# EAGLE schematic WeddingWidget-pogo (EAGLE 6.3)
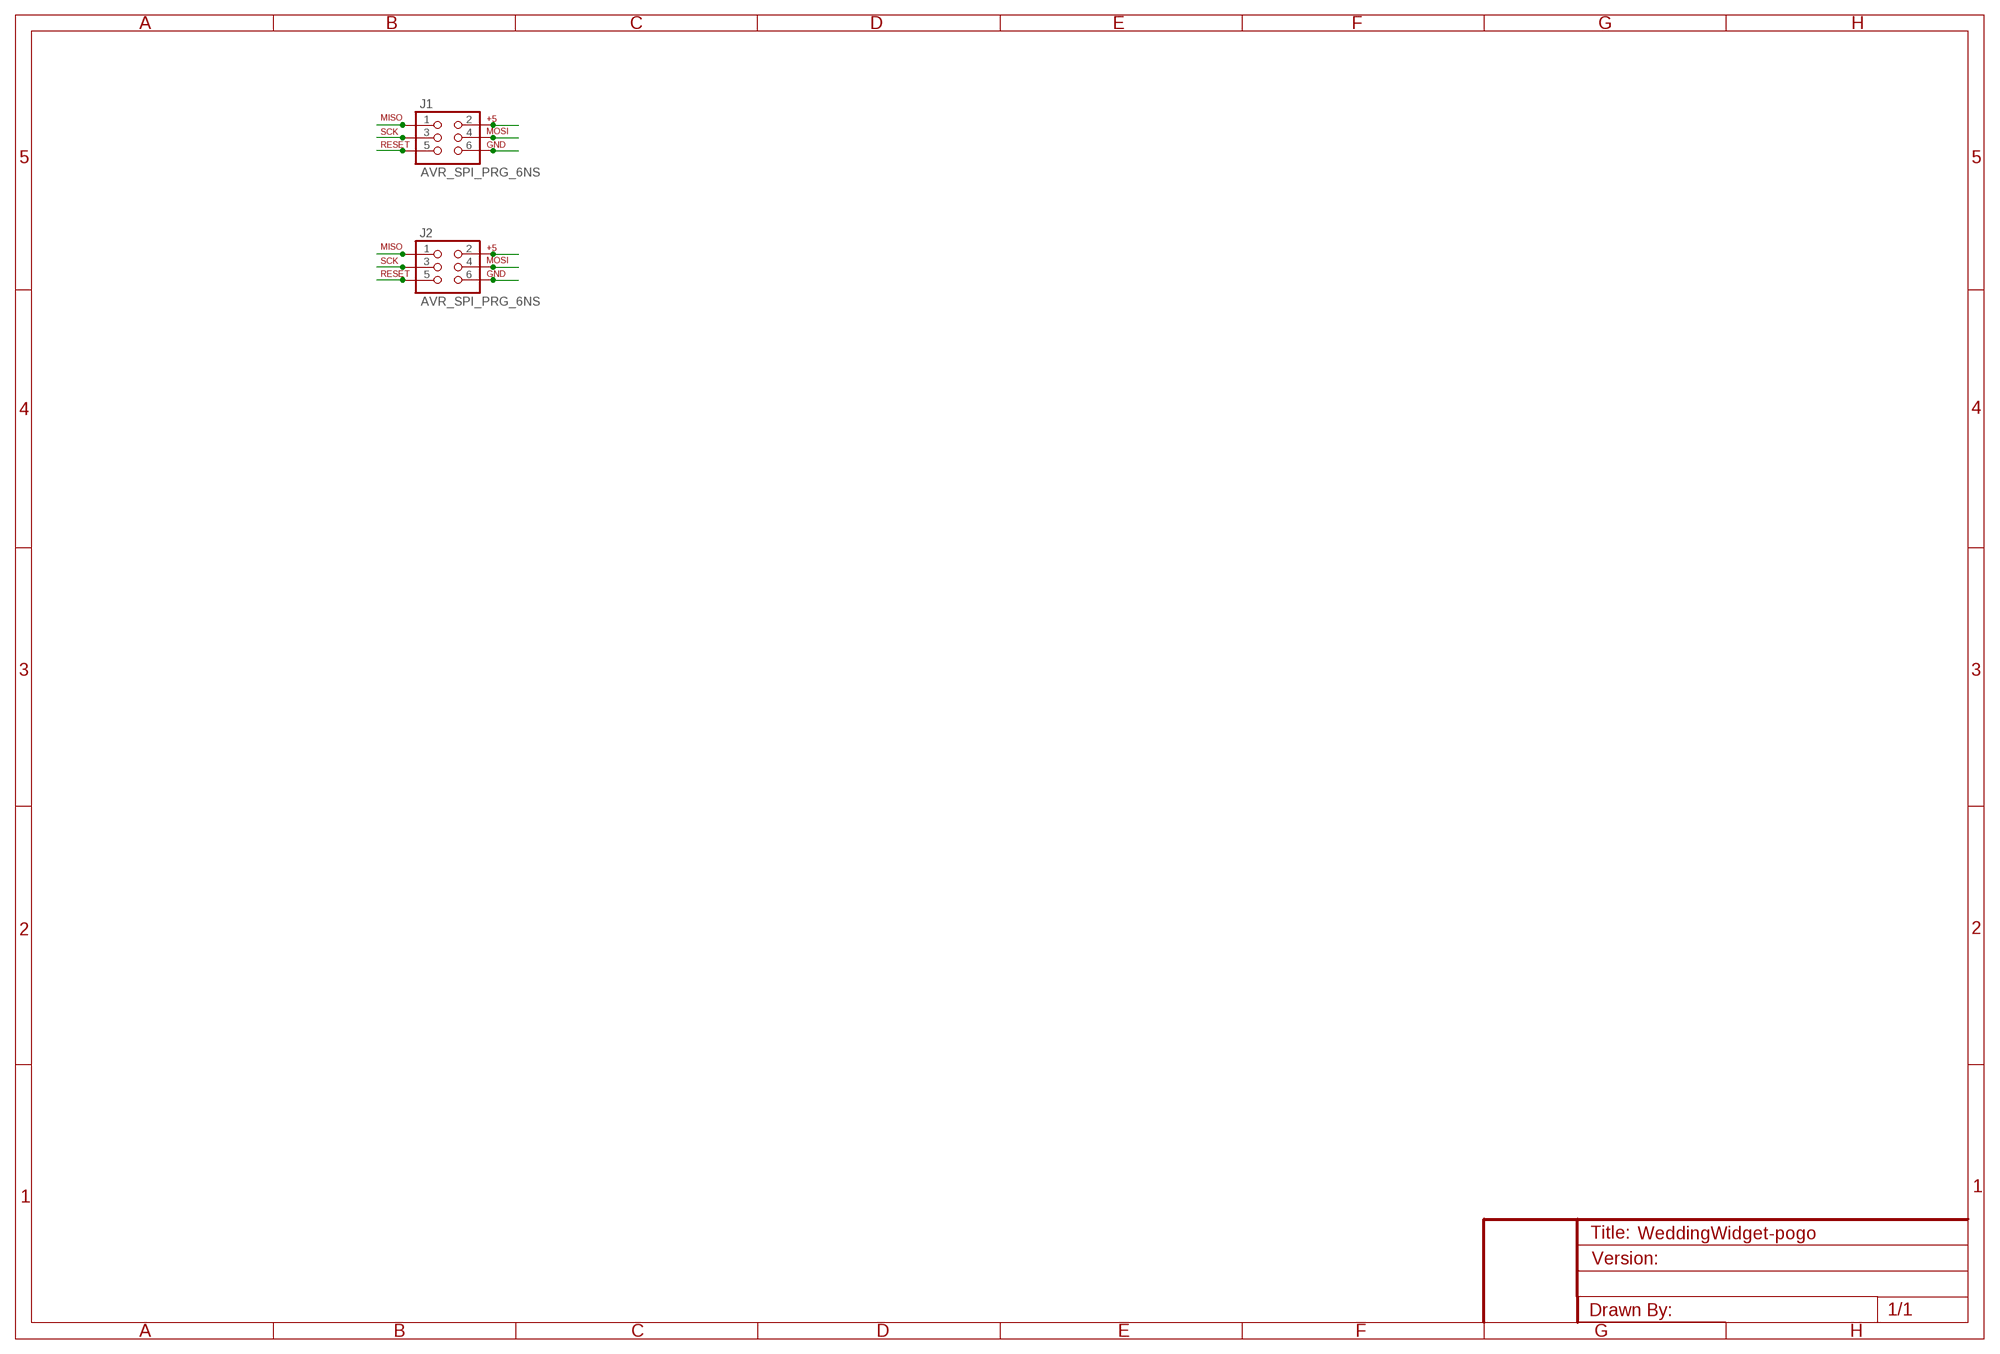
[diagram p0: schematic, sheet 1]

## Parts
J1  AVR_SPI_PRG_6NS  [2X3-NS]
J2  AVR_SPI_PRG_6NS  [2X3-NS]

## Nets
GND: J1.6 J2.6
MISO: J1.1 J2.1
MOSI: J1.4 J2.4
RST: J1.5 J2.5
SCK: J1.3 J2.3
VCC: J1.2 J2.2

## Library data of the parts
J1 J2 = SparkFun:AVR_SPI_PRG_6: AVR ISP 6 Pin This is the reduced ISP connector for AVR programming. Common on Arduino. This footprint will take up less PCB space and can be used with a 10-pin to 6-pin adapter such as SKU: BOB-08508